# Altium schematic sheet Copy of Sheet1.SchDoc
size A4; SheetNumber: 1; SheetTotal: 1
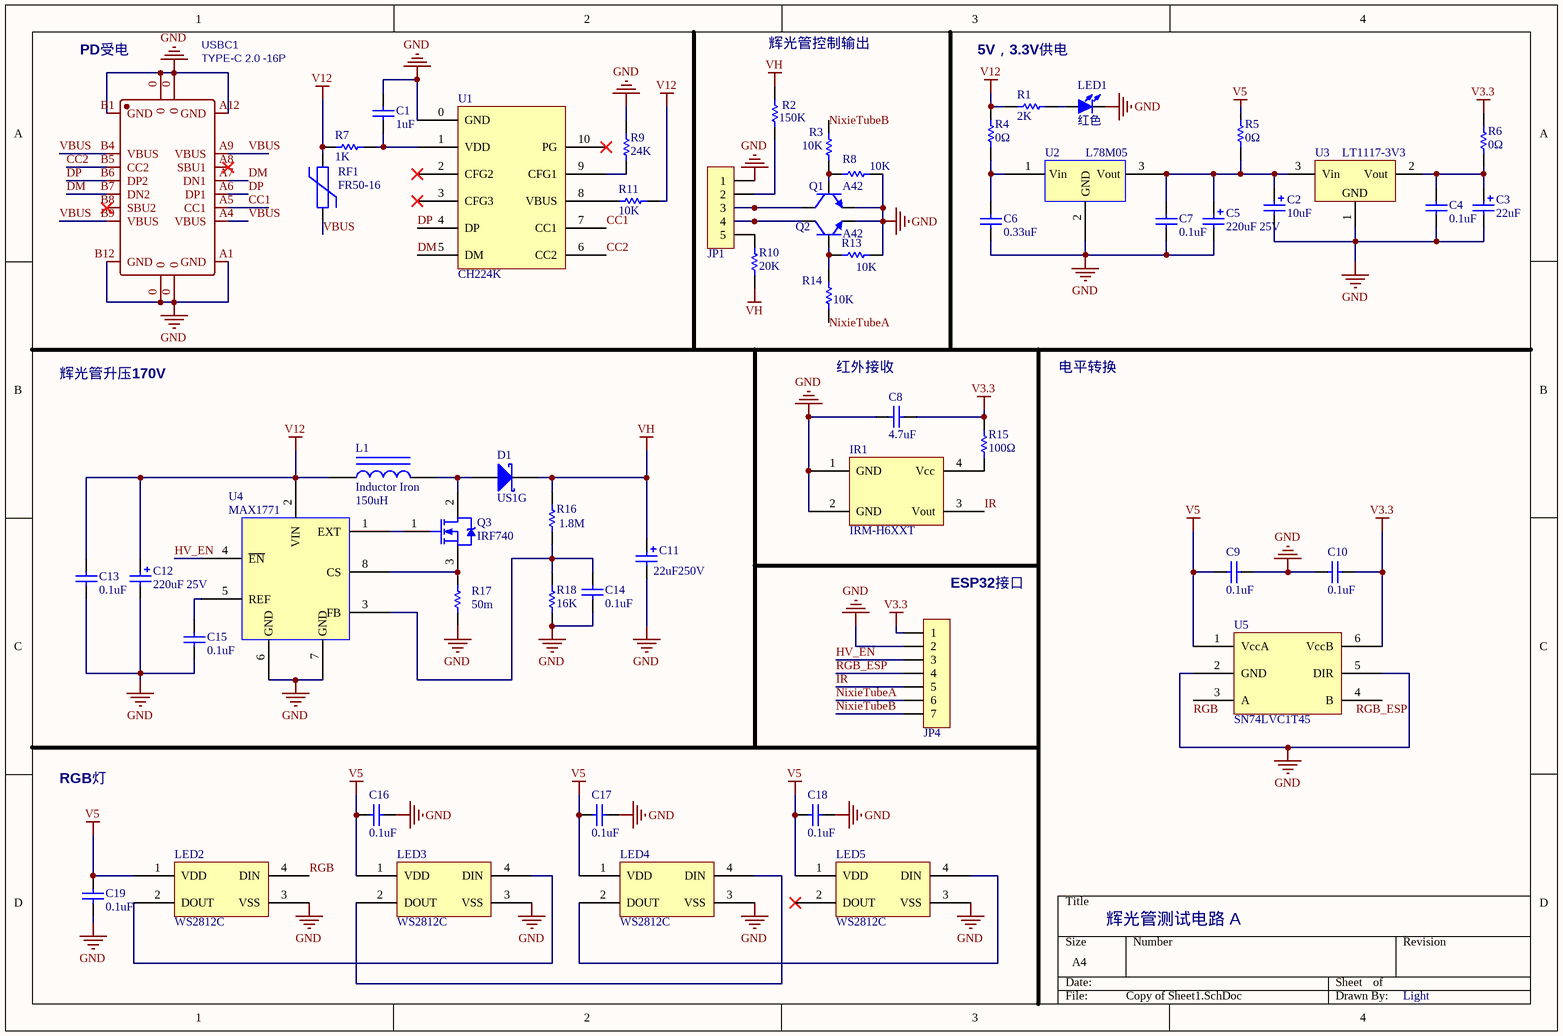
[diagram p0: Copy of Sheet1.SchDoc]

## Parts
C1  value 1uF  [C 0805_L]  (hidden comment: Cap)
C2  value 10uF  [CM B(4*5.4)]  (hidden comment: Cap Pol1)
C3  value 22uF  [CD C(6032)]  (hidden comment: Cap Pol1)
C4  value 0.1uF  [C 0805_L]  (hidden comment: Cap)
C5  value 220uF 25V  [CM E(8*10.2)]  (hidden comment: Cap Pol1)
C6  value 0.33uF  [C 0805_L]  (hidden comment: Cap)
C7  value 0.1uF  [C 0805_L]  (hidden comment: Cap)
C8  value 4.7uF  [C 0805_L]  (hidden comment: Cap)
C9  value 0.1uF  [C 0805_L]  (hidden comment: Cap)
C10  value 0.1uF  [C 0805_L]  (hidden comment: Cap)
C11  value 22uF250V  [CAP 5.0*10*16-H - GD]  (hidden comment: Cap Pol1)
C12  value 220uF 25V  [CM E(8*10.2)]  (hidden comment: Cap Pol1)
C13  value 0.1uF  [C 0805_L]  (hidden comment: Cap)
C14  value 0.1uF  [C 0805_L]  (hidden comment: Cap)
C15  value 0.1uF  [C 0805_L]  (hidden comment: Cap)
C16  value 0.1uF  [C 0805_L]  (hidden comment: Cap)
C17  value 0.1uF  [C 0805_L]  (hidden comment: Cap)
C18  value 0.1uF  [C 0805_L]  (hidden comment: Cap)
C19  value 0.1uF  [C 0805_L]  (hidden comment: Cap)
D1  US1G  [SMA]
IR1  IRM-H6XXT  [SMD4_IR]
JP1  HDR-1X5  [XH2.54-LI-5P]  (value not drawn)
JP4  HDR-1X7  [HDR2.54-LI-7P]  (value not drawn)
L1  Inductor Iron  value 150uH  [CDRH127]
LED1  红色  [LED 1206R]
LED2  WS2812C  [WS2812]
LED3  WS2812C  [WS2812]
LED4  WS2812C  [WS2812]
LED5  WS2812C  [WS2812]
Q1  A42  [SOT23-3L]
Q2  A42  [SOT23-3L]
Q3  IRF740  [TO-263-2L]
R1  value 2K  [R 0805_L]  (hidden comment: Resistor)
R2  value 150K  [R 0805_L]  (hidden comment: Res Semi)
R3  value 10K  [R 0805_L]  (hidden comment: Resistor)
R4  value 0Ω  [R 0805_L]  (hidden comment: Resistor)
R5  value 0Ω  [R 0805_L]  (hidden comment: Resistor)
R6  value 0Ω  [R 0805_L]  (hidden comment: Resistor)
R7  value 1K  [R 1206_L]  (hidden comment: Resistor)
R8  value 10K  [R 0805_L]  (hidden comment: Resistor)
R9  value 24K  [R 0805_L]  (hidden comment: Resistor)
R10  value 20K  [R 0805_L]  (hidden comment: Res Semi)
R11  value 10K  [R 0805_L]  (hidden comment: Resistor)
R13  value 10K  [R 0805_L]  (hidden comment: Resistor)
R14  value 10K  [R 0805_L]  (hidden comment: Resistor)
R15  value 100Ω  [R 0805_L]  (hidden comment: Resistor)
R16  value 1.8M  [R 0805_L]  (hidden comment: Res Semi)
R17  value 50m  [R 1206_L]  (hidden comment: Res Semi)
R18  value 16K  [R 0805_L]  (hidden comment: Resistor)
RF1  FR50-16  [FU 1206]
U1  CH224K  [ESSOP10]
U2  L78M05  [TO-252]
U3  LT1117-3V3  [SOT223_L]
U4  MAX1771  [SOIC8]
U5  SN74LVC1T45  [SOT23-6L]
USBC1  TYPE-C 2.0 -16P  [USB-C-SMD_TYPE-C-USB-5]

## Nets
GND: C1.2 C2.2 C3.2 C4.1 C5.2 C6.1 C7.1 C8.2 C9.1 C10.2 C11.2 C12.2 C13.1 C14.1 C15.2 C16.1 C17.1 C18.1 C19.1 IR1.1(GND) IR1.2(GND) JP1.1 JP4.2 LED1.2(K) LED2.3(VSS) LED3.3(VSS) LED4.3(VSS) LED5.3(VSS) Q1.2(E) Q2.2(E) R8.2 R9.1 R13.2 R17.2 R18.1 U1.0(GND) U2.2(GND) U3.1(GND) U4.6(GND) U4.7(GND) U5.2(GND) U5.5(DIR) USBC1.0 USBC1.A1(GND) USBC1.A12(GND) USBC1.B1(GND) USBC1.B12(GND)
V3.3: C8.1 C10.1 JP4.1 R6.2 R15.2 U5.6(VccB)
V5: C9.2 C16.2 C17.2 C18.2 C19.2 LED2.1(VDD) LED3.1(VDD) LED4.1(VDD) LED5.1(VDD) R5.2 U5.1(VccA)
V12: C12.1 C13.2 L1.1 R1.2 R4.2 R7.2 R11.1 RF1.2 U4.2(VIN)
VH: C11.1 D1.2(K) R2.2 R10.1 R16.1
CC1: U1.7(CC1) USBC1.A5(CC1)
CC2: U1.6(CC2) USBC1.B5(CC2)
DM: U1.5(DM) USBC1.A7(DN1) USBC1.B7(DN2)
DP: U1.4(DP) USBC1.A6(DP1) USBC1.B6(DP2)
HV_EN: JP4.3 U4.4(~{EN})
IR: IR1.3(Vout) JP4.5
NixieTubeA: JP4.6 R14.2
NixieTubeB: JP4.7 R3.2
RGB: LED2.4(DIN) U5.3(A)
RGB_ESP: JP4.4 U5.4(B)
VBUS: RF1.1 USBC1.A4(VBUS) USBC1.A9(VBUS) USBC1.B4(VBUS) USBC1.B9(VBUS)
NetC1_1: C1.1 R7.1 U1.1(VDD)
NetC2_1: C2.1 C5.1 C7.2 R5.1 U2.3(Vout) U3.3(Vin)
NetC3_1: C3.1 C4.2 R6.1 U3.2(Vout)
NetC6_2: C6.2 R4.1 U2.1(Vin)
NetC14_2: C14.2 R16.2 R18.2 U4.3(FB)
NetC15_1: C15.1 U4.5(REF)
NetD1_1: D1.1(A) L1.2 Q3.2(D)
NetIR1_4: IR1.4(Vcc) R15.1
NetJP1_2: JP1.2 R2.1
NetJP1_3: JP1.3 Q1.3(C)
NetJP1_4: JP1.4 Q2.3(C)
NetJP1_5: JP1.5 R10.2
NetLED1_1: LED1.1(A) R1.1
NetLED2_2: LED2.2(DOUT) LED3.4(DIN)
NetLED3_2: LED3.2(DOUT) LED4.4(DIN)
NetLED4_2: LED4.2(DOUT) LED5.4(DIN)
NetQ1_1: Q1.1(B) R3.1 R8.1
NetQ2_1: Q2.1(B) R13.1 R14.1
NetQ3_1: Q3.1(G) U4.1(EXT)
NetQ3_3: Q3.3(S) R17.1 U4.8(CS)
NetR9_2: R9.2 U1.9(CFG1)
NetR11_2: R11.2 U1.8(VBUS)

Not connected (* = marked no-connect by the designer): LED5 2(DOUT)*; U1 2(CFG2)* 3(CFG3)* 10(PG)*; USBC1 A8(SBU1)* B8(SBU2)*

## Notes on the sheet
- (near USBC1) PD受电
- (near R2) 辉光管控制输出
- 5V，3.3V供电
- 辉光管升压170V
- 红外接收
- 电平转换
- ESP32接口
- RGB灯
- 辉光管测试电路 A
- Light

## Library data of the parts
C1 C4 C6-C10 C13-C19 = Cap: Capacitor; Published: 8-Jun-2000; LatestRevisionDate: 17-Jul-2002; LatestRevisionNote: Re-released for DXP Platform.; PackageReference: RAD-0.3; Publisher: Altium Limited; PackageDescription: Radial Cap, Thru-Hole; 2 Leads; 0.3 in Pin Spacing
C2 C3 = Cap Pol1: Polarized Capacitor (Radial); Published: 8-Jun-2000; LatestRevisionDate: 17-Jul-2002; LatestRevisionNote: Re-released for DXP Platform.; PackageReference: RB7.6-15; Publisher: Altium Limited
C5 C12 = Cap Pol1_2: Polarized Capacitor (Radial); Voltage: 16V; Published: 8-Jun-2000; LatestRevisionDate: 17-Jul-2002; LatestRevisionNote: Re-released for DXP Platform.; PackageReference: RB7.6-15; Publisher: Altium Limited; PackageDescription: Polarized Capacitor (Radial); 2 Leads
C11 = Cap Pol1_3: Polarized Capacitor (Radial); Published: 8-Jun-2000; LatestRevisionDate: 17-Jul-2002; LatestRevisionNote: Re-released for DXP Platform.; PackageReference: RB7.6-15; Publisher: Altium Limited; PackageDescription: Polarized Capacitor (Radial); 2 Leads
D1 = D Schottky: Schottky Diode; Published: 8-Jun-2000; LatestRevisionDate: 17-Jul-2002; LatestRevisionNote: Re-released for DXP Platform.; PackageReference: SMB; Publisher: Altium Limited; PackageDescription: DO-214-AA/SMB; 2 C-Bend Leads; Body 5.3 x 3.6 mm, inc. leads (LxW); Code_JEDEC: DO-214-AA
IR1 = IR
JP1 = Header 5: 5P接插件; 版权归属: 封装库来自淘宝 ID：黄晶宝石; BOM名称: 5P接插件; 学习资源: https://shop463601444.taobao.com
JP4 = Header 7: 7P接插件; 版权归属: 封装库来自淘宝 ID：黄晶宝石; BOM名称: 7P接插件; 学习资源: https://shop463601444.taobao.com
L1 = Inductor Iron: Magnetic-Core Inductor; Published: 24-Mar-1999; LatestRevisionDate: 17-Jul-2002; LatestRevisionNote: Re-released for DXP Platform.; PackageReference: AXIAL-0.9; Publisher: Altium Limited; PackageDescription: Axial Device, Thru-Hole; 2 Leads; 0.9 in Pin Spacing
LED1 = LED-SMD: 贴片LED; 版权归属: 封装库来自淘宝 ID：黄晶宝石; BOM名称: 贴片LED; 学习资源: https://shop463601444.taobao.com
LED2-LED5 = WS2812: RGB发光管
Q1 Q2 = BCP68: NPN三极管; Published: 17-Sep-2003; LatestRevisionDate: 12-Dec-2006; LatestRevisionNote: IPC-7351 Footprint Added.; DatasheetVersion: 8-Apr-1999; PackageVersion: Aug-2001; PackageReference: SOT223; Publisher: Altium Limited; PackageDescription: 4-Pin SOT-223 Package 2.3 mm Pitch, 7 mm Lead Span; ComponentLink1Description: Manufacturer Link; ComponentLink1URL: http://www.semiconductors.philips.com/; ComponentLink2Description: Datasheet; ComponentLink2URL: http://www.semiconductors.philips.com/acrobat/datasheets/BCP68_4.pdf
Q3 = NMOS-2: N-Channel Power MOSFET; Note: Pin 2 is electrically connected to pin 4.; Published: 8-Jun-2000; LatestRevisionDate: 17-Jul-2002; LatestRevisionNote: Re-released for DXP Platform.; DatasheetVersion: PD-9.814; PackageVersion: Feb-1997; PackageReference: TO-220AB; Publisher: Altium Limited; PackageDescription: TO, Thru-Hole, Vertical, Heatsink Mounted; 3 In-Line Leads; Pitch 2.54 mm; ComponentLink1Description: Manufacturer Link; ComponentLink1URL: http://www.irf.com/
R2 R10 R16 R17 = Res Semi: Semiconductor Resistor; Published: 8-Jun-2000; LatestRevisionDate: 17-Jul-2002; LatestRevisionNote: Re-released for DXP Platform.; PackageReference: AXIAL-0.5; Publisher: Altium Limited
RF1 = PPTC: PPTC自恢复保险丝; 版权归属: 封装库来自淘宝卖家 ID：黄晶宝石; BOM名称: PPTC自恢复保险丝; 学习资源: https://shop463601444.taobao.com
U1 = CH224K: PD协议受电芯片
U3 = AMS1117: 三端稳压芯片; BOM名称: 稳压芯片; 版权归属: 源创客; 学习资源: www.ooocke.com
U5 = SN74LVC1T45: 单路逻辑电平转换
USBC1 = USB2.0 Type-C 16Pin母座: USB2.0 Type-C 母座 16Pin; BOM_Manufacturer: LCSC; BOM_Supplier: LCSC; BOM_Manufacturer Part: -; spicePre: U; spiceSymbolName: TYPE-C 3.1 -16P_C168689
R1 R3-R9 R11 R13-R15 R18 = Resistor: Published: 8-Jun-2000; LatestRevisionDate: 17-Jul-2002; LatestRevisionNote: Re-released for DXP Platform.; PackageReference: AXIAL-0.5; Publisher: Altium Limited